# EAGLE schematic BusBoard 2 (EAGLE 7.3.0)
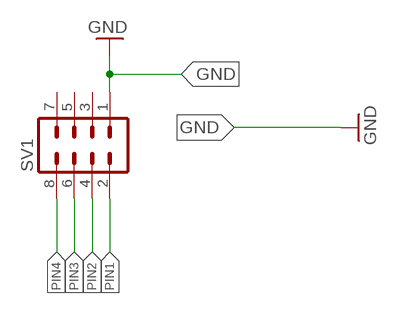
[diagram p0: schematic, sheet 1]

## Parts
SV1  MA04-2  [MA04-2]

## Nets
GND: SV1.1
PIN1: SV1.2
PIN2: SV1.4
PIN3: SV1.6
PIN4: SV1.8
Unconnected: SV1.3 SV1.5 SV1.7

## Library data of the parts
SV1 = con-lstb:MA04-2: PIN HEADER; OC_FARNELL: unknown; OC_NEWARK: unknown